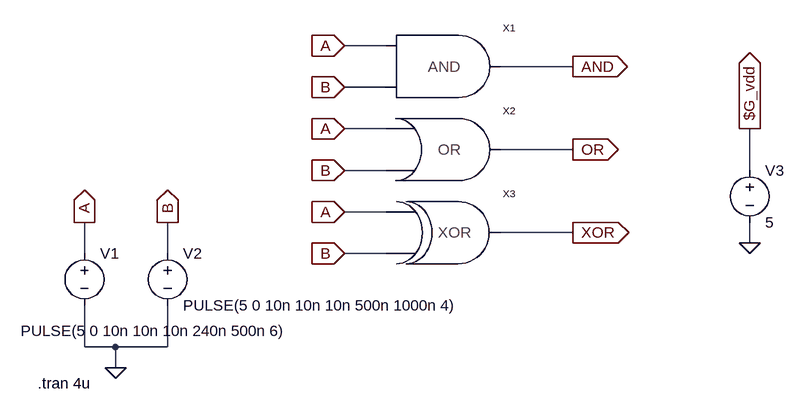
[diagram p0: schematic test_gates.asc]
test_gates.asc, the LTspice schematic file:
Version 4
SHEET 1 880 680
WIRE 64 80 0 80
WIRE 352 112 240 112
WIRE 64 144 0 144
WIRE 64 208 0 208
WIRE 352 240 240 240
WIRE 64 272 0 272
WIRE 624 272 624 208
WIRE 64 336 0 336
WIRE 352 368 240 368
WIRE 624 384 624 352
WIRE -400 400 -400 352
WIRE -272 400 -272 352
WIRE 64 400 0 400
WIRE -400 544 -400 480
WIRE -352 544 -400 544
WIRE -272 544 -272 480
WIRE -272 544 -352 544
WIRE -352 576 -352 544
FLAG 0 80 A
IOPIN 0 80 In
FLAG 0 144 B
IOPIN 0 144 In
FLAG 0 208 A
IOPIN 0 208 In
FLAG 0 272 B
IOPIN 0 272 In
FLAG 0 336 A
IOPIN 0 336 In
FLAG 0 400 B
IOPIN 0 400 In
FLAG 352 112 AND
IOPIN 352 112 Out
FLAG 352 240 OR
IOPIN 352 240 Out
FLAG 352 368 XOR
IOPIN 352 368 Out
FLAG -352 576 0
FLAG -400 352 A
IOPIN -400 352 Out
FLAG -272 352 B
IOPIN -272 352 Out
FLAG 624 384 0
FLAG 624 208 $G_vdd
IOPIN 624 208 Out
SYMBOL AND_2 80 112 R0
SYMATTR InstName X1
SYMBOL or_2 80 240 R0
SYMATTR InstName X2
SYMBOL XOR_2 96 368 R0
SYMATTR InstName X3
SYMBOL voltage -400 384 R0
WINDOW 3 -98 135 Left 2
WINDOW 123 0 0 Left 0
WINDOW 39 0 0 Left 0
SYMATTR InstName V1
SYMATTR Value PULSE(5 0 10n 10n 10n 240n 500n 6)
SYMBOL voltage -272 384 R0
WINDOW 123 0 0 Left 0
WINDOW 39 0 0 Left 0
SYMATTR InstName V2
SYMATTR Value PULSE(5 0 10n 10n 10n 500n 1000n 4)
SYMBOL voltage 624 256 R0
SYMATTR InstName V3
SYMATTR Value 5
TEXT -472 600 Left 2 !.tran 4u

The netlist it stands for:
* test_gates.asc
XX1 A B AND AND_2  ; pins Vin1 Vin2 Vout
XX2 A B OR or_2  ; pins Vin1 Vin2 Vout
XX3 A B XOR XOR_2  ; pins Vin1 Vin2 Vout
V1 A 0 PULSE(5 0 10n 10n 10n 240n 500n 6)
V2 B 0 PULSE(5 0 10n 10n 10n 500n 1000n 4)
V3 $G_vdd 0 5
.tran 4u
.backanno
.end